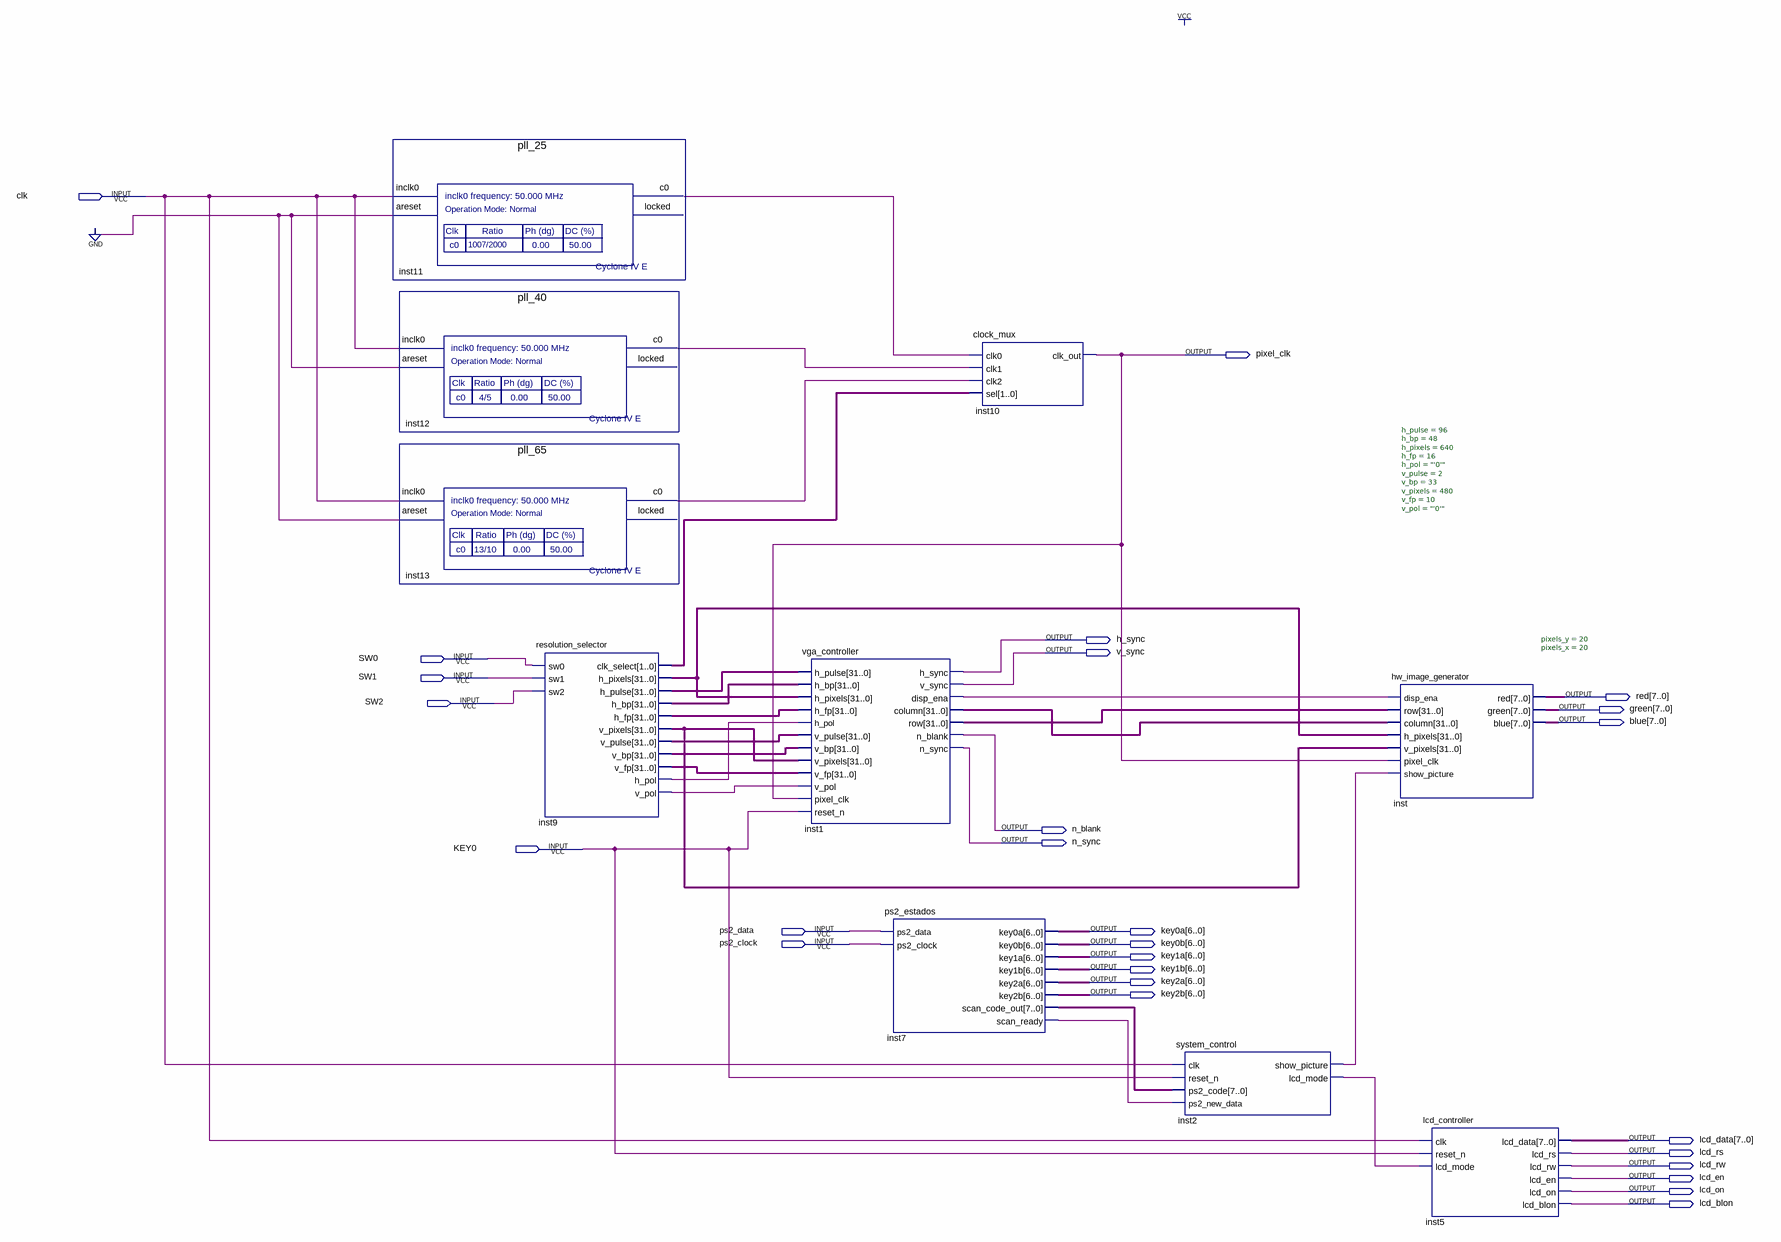
[diagram p0: schematic sheet]
// Quartus schematic vga_with_hw_test_image.bdf as structural Verilog: 10 symbols, 27 pins
module vga_with_hw_test_image (
  input  clk,
  input  SW0,
  input  SW1,
  input  SW2,
  input  KEY0,
  input  ps2_data,
  input  ps2_clock,
  output pixel_clk,
  output h_sync,
  output v_sync,
  output [7:0] red,
  output [7:0] green,
  output [7:0] blue,
  output n_blank,
  output n_sync,
  output [6:0] key0a,
  output [6:0] key0b,
  output [6:0] key1a,
  output [6:0] key1b,
  output [6:0] key2a,
  output [6:0] key2b,
  output [7:0] lcd_data,
  output lcd_rs,
  output lcd_rw,
  output lcd_en,
  output lcd_on,
  output lcd_blon
);

  wire inst1_disp_ena, inst2_lcd_mode, inst2_show_picture, inst7_scan_ready, inst9_h_pol, inst9_v_pol,
       inst11_c0, inst12_c0, inst13_c0;
  wire [1:0] inst9_clk_select;
  wire [7:0] inst7_scan_code_out;
  wire [31:0] inst1_column, inst1_row, inst9_h_bp, inst9_h_fp, inst9_h_pixels, inst9_h_pulse, inst9_v_bp,
       inst9_v_fp, inst9_v_pixels, inst9_v_pulse;

  pll_25 inst11 (.inclk0(clk), .areset(1'b0), .c0(inst11_c0));  // open: locked
  pll_40 inst12 (.inclk0(clk), .areset(1'b0), .c0(inst12_c0));  // open: locked
  pll_65 inst13 (.inclk0(clk), .areset(1'b0), .c0(inst13_c0));  // open: locked
  resolution_selector inst9 (
    .sw0(SW0), .sw1(SW1), .sw2(SW2), .clk_select(inst9_clk_select), .h_pixels(inst9_h_pixels),
    .h_pulse(inst9_h_pulse), .h_bp(inst9_h_bp), .h_fp(inst9_h_fp), .v_pixels(inst9_v_pixels),
    .v_pulse(inst9_v_pulse), .v_bp(inst9_v_bp), .v_fp(inst9_v_fp), .h_pol(inst9_h_pol), .v_pol(inst9_v_pol));
  vga_controller #(.h_pulse(96), .h_bp(48), .h_pixels(640), .h_fp(16), .h_pol("'0'"), .v_pulse(2), .v_bp(33), .v_pixels(480), .v_fp(10), .v_pol("'0'")) inst1 (
    .h_pulse(inst9_h_pulse), .h_bp(inst9_h_bp), .h_pixels(inst9_h_pixels), .h_fp(inst9_h_fp),
    .h_pol(inst9_h_pol), .v_pulse(inst9_v_pulse), .v_bp(inst9_v_bp), .v_pixels(inst9_v_pixels),
    .v_fp(inst9_v_fp), .v_pol(inst9_v_pol), .pixel_clk(pixel_clk), .reset_n(KEY0), .h_sync(h_sync),
    .v_sync(v_sync), .disp_ena(inst1_disp_ena), .column(inst1_column), .row(inst1_row), .n_blank(n_blank),
    .n_sync(n_sync));
  ps2_estados inst7 (
    .ps2_data(ps2_data), .ps2_clock(ps2_clock), .key0a(key0a), .key0b(key0b), .key1a(key1a), .key1b(key1b),
    .key2a(key2a), .key2b(key2b), .scan_code_out(inst7_scan_code_out), .scan_ready(inst7_scan_ready));
  clock_mux inst10 (.clk0(inst11_c0), .clk1(inst12_c0), .clk2(inst13_c0), .sel(inst9_clk_select), .clk_out(pixel_clk));
  system_control inst2 (
    .clk(clk), .reset_n(KEY0), .ps2_code(inst7_scan_code_out), .ps2_new_data(inst7_scan_ready),
    .show_picture(inst2_show_picture), .lcd_mode(inst2_lcd_mode));
  hw_image_generator #(.pixels_y(20), .pixels_x(20)) inst (
    .disp_ena(inst1_disp_ena), .row(inst1_row), .column(inst1_column), .h_pixels(inst9_h_pixels),
    .v_pixels(inst9_v_pixels), .pixel_clk(pixel_clk), .show_picture(inst2_show_picture), .red(red),
    .green(green), .blue(blue));
  lcd_controller inst5 (
    .clk(clk), .reset_n(KEY0), .lcd_mode(inst2_lcd_mode), .lcd_data(lcd_data), .lcd_rs(lcd_rs),
    .lcd_rw(lcd_rw), .lcd_en(lcd_en), .lcd_on(lcd_on), .lcd_blon(lcd_blon));
endmodule
